# EAGLE design 04A-020 (EAGLE 9.6.2)
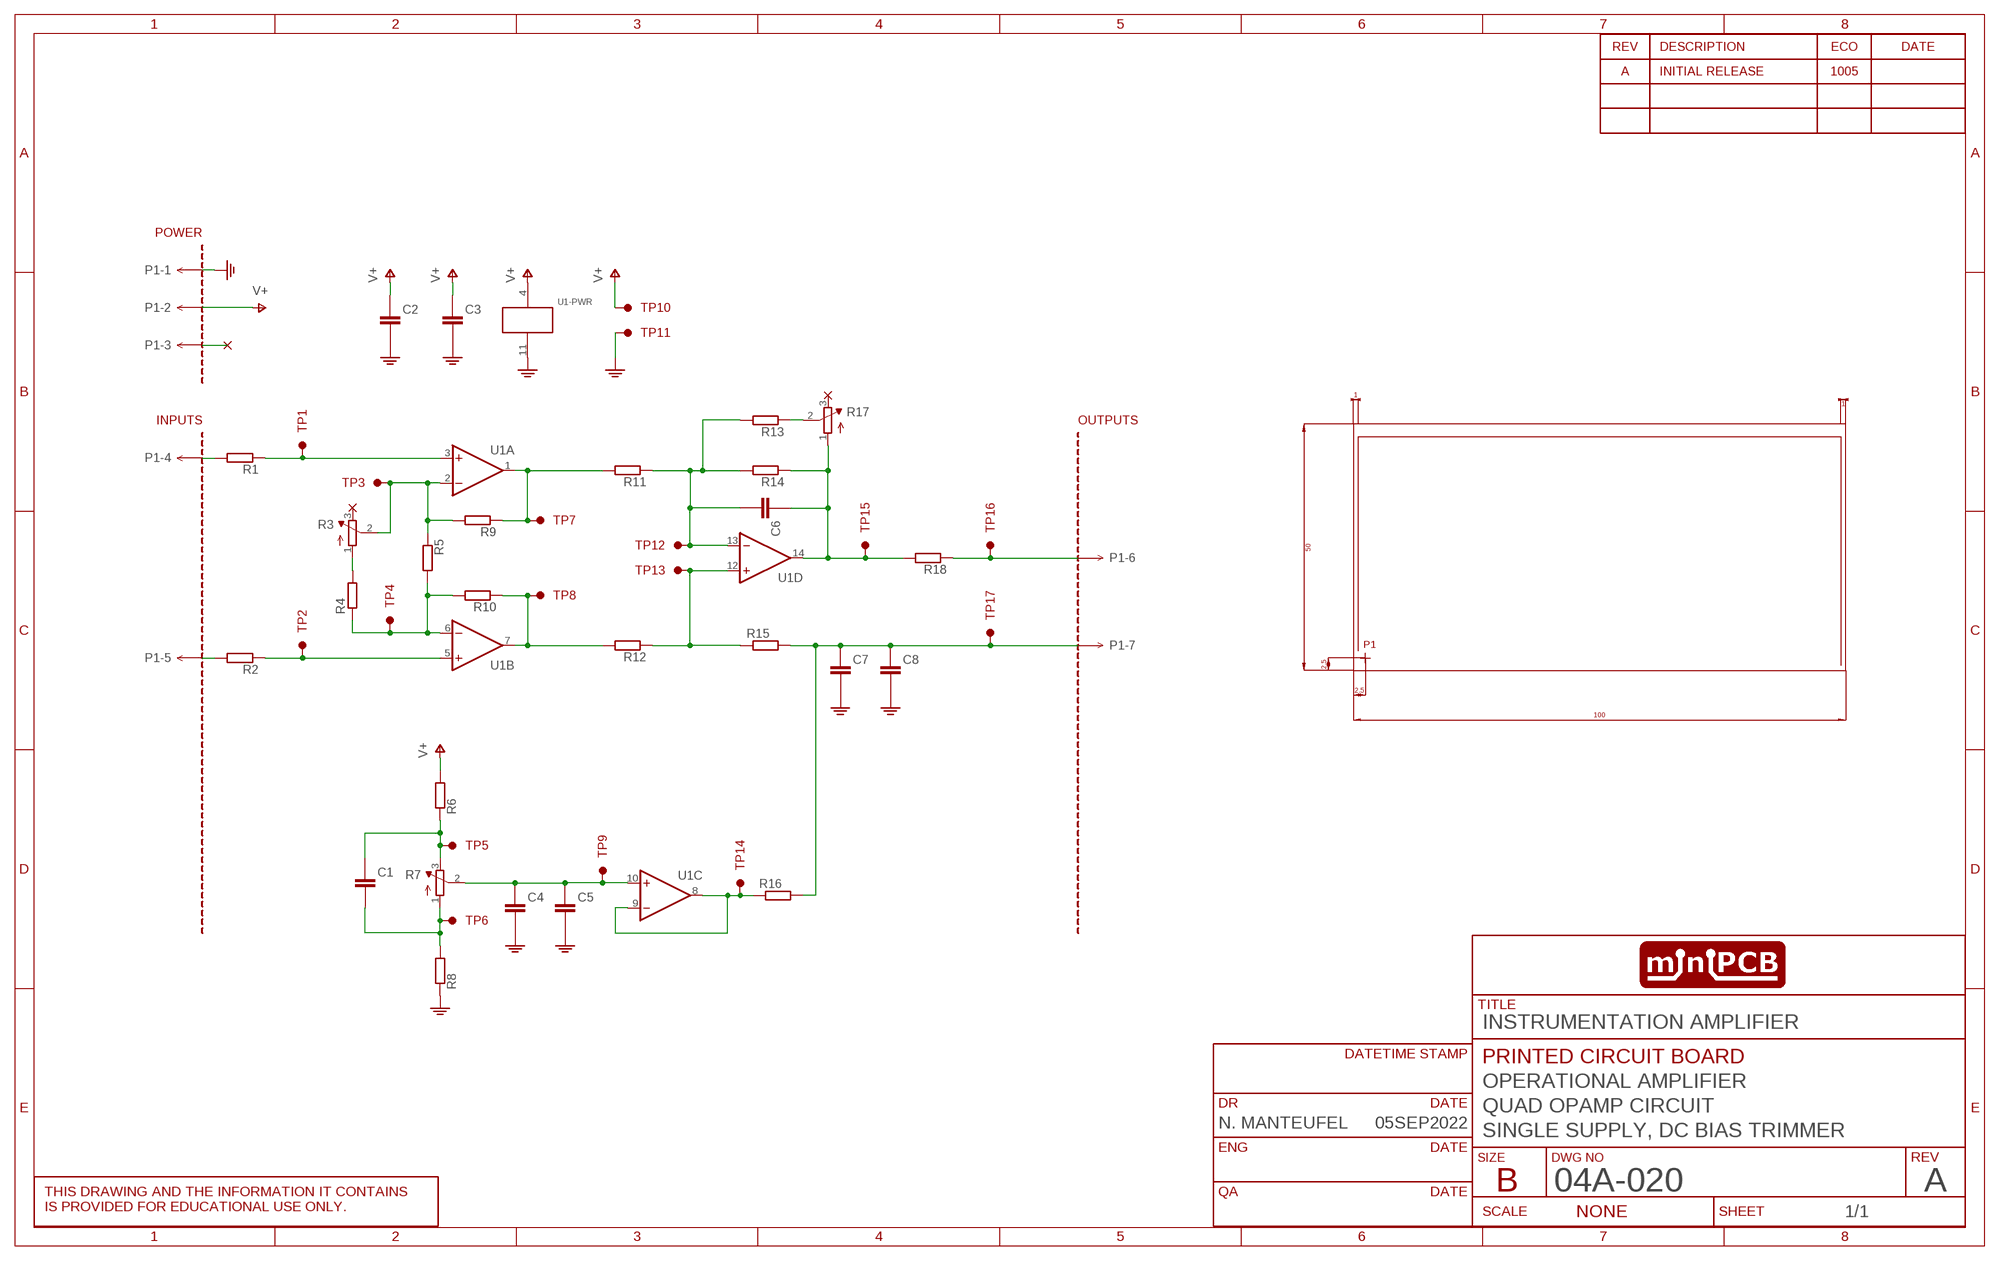
[diagram p0: schematic, sheet 1]
SHEET1 (SCHEMATIC): CIRCUIT_CATEGORY: OPERATIONAL AMPLIFIER; CIRCUIT_NAME: QUAD OPAMP CIRCUIT; CIRCUIT_VARIANT: SINGLE SUPPLY, DC BIAS TRIMMER; DR: N. MANTEUFEL; DR_DATE: 05SEP2022; PCB_PCBA: PRINTED CIRCUIT BOARD; REVA: A; REVA_ECO: 1005; REVISION: A; TITLE: INSTRUMENTATION AMPLIFIER

## Parts
C1  CAPACITORTHD  [C050-024X044]
C2  CAPACITOR_10  [C5MM]
C3  CAPACITORTHD  [C050-024X044]
C4  CAPACITOR_10  [C5MM]
C5  CAPACITORTHD  [C050-024X044]
C6  CAPACITORTHD  [C050-024X044]
C7  CAPACITOR_10  [C5MM]
C8  CAPACITORTHD  [C050-024X044]
P1  MINIPCB_7P  [PINS_1X7]
R1  RESISTOR10MM  [0207/10]
R2  RESISTOR10MM  [0207/10]
R3  TRIMPOT0.100THD  [TRIM_0100]
R4  RESISTOR10MM  [0207/10]
R5  RESISTOR10MM  [0207/10]
R6  RESISTOR10MM  [0207/10]
R7  TRIMPOT0.100THD  [TRIM_0100]
R8  RESISTOR10MM  [0207/10]
R9  RESISTOR10MM  [0207/10]
R10  RESISTOR10MM  [0207/10]
R11  RESISTOR10MM  [0207/10]
R12  RESISTOR10MM  [0207/10]
R13  RESISTOR10MM  [0207/10]
R14  RESISTOR10MM  [0207/10]
R15  RESISTOR10MM  [0207/10]
R16  RESISTOR10MM  [0207/10]
R17  TRIMPOT0.100THD  [TRIM_0100]
R18  RESISTOR10MM  [0207/10]
TP1  TESTPOINTKE5000-SMTEXT  [PINS_1_TESTPOINT_KE5000_NOTEXT]
TP2  TESTPOINTKE5000-SMTEXT  [PINS_1_TESTPOINT_KE5000_NOTEXT]
TP3  TESTPOINTKE5000-SMTEXT  [PINS_1_TESTPOINT_KE5000_NOTEXT]
TP4  TESTPOINTKE5000-SMTEXT  [PINS_1_TESTPOINT_KE5000_NOTEXT]
TP5  TESTPOINTKE5000-SMTEXT  [PINS_1_TESTPOINT_KE5000_NOTEXT]
TP6  TESTPOINTKE5000-SMTEXT  [PINS_1_TESTPOINT_KE5000_NOTEXT]
TP7  TESTPOINTKE5000-SMTEXT  [PINS_1_TESTPOINT_KE5000_NOTEXT]
TP8  TESTPOINTKE5000-SMTEXT  [PINS_1_TESTPOINT_KE5000_NOTEXT]
TP9  TESTPOINTKE5000-SMTEXT  [PINS_1_TESTPOINT_KE5000_NOTEXT]
TP10  TESTPOINTKE5000-SMTEXT  [PINS_1_TESTPOINT_KE5000_NOTEXT]
TP11  TESTPOINTKE5000-SMTEXT  [PINS_1_TESTPOINT_KE5000_NOTEXT]
TP12  TESTPOINTKE5000-SMTEXT  [PINS_1_TESTPOINT_KE5000_NOTEXT]
TP13  TESTPOINTKE5000-SMTEXT  [PINS_1_TESTPOINT_KE5000_NOTEXT]
TP14  TESTPOINTKE5000-SMTEXT  [PINS_1_TESTPOINT_KE5000_NOTEXT]
TP15  TESTPOINTKE5000-SMTEXT  [PINS_1_TESTPOINT_KE5000_NOTEXT]
TP16  TESTPOINTKE5000-SMTEXT  [PINS_1_TESTPOINT_KE5000_NOTEXT]
TP17  TESTPOINTKE5000-SMTEXT  [PINS_1_TESTPOINT_KE5000_NOTEXT]
U1  OPAMP_QUADTHD  [DIL14]
U2  CLASSIC-50X100  [PCB50X100]

## Nets
BIAS: C4.+ C5.1(+) R7.2(S) TP9.1 U1.10(C:+IN)
GND: C2.- C3.2(-) C4.- C5.2(-) C7.- C8.2(-) P1.1 R8.1 TP11.1 U1.11(-PWR:V-)
N$1: R12.1 R15.1 TP13.1 U1.12(D:+IN)
N$2: C7.+ C8.1(+) P1.7 R15.2 R16.2 TP17.1
N$3: R2.1 TP2.1 U1.5(B:+IN)
N$4: R1.1 TP1.1 U1.3(A:+IN)
N$5: R3.2(S) R5.1 R9.2 TP3.1 U1.2(A:-IN)
N$6: R4.1 R5.2 R10.2 TP4.1 U1.6(B:-IN)
N$7: R9.1 R11.2 TP7.1 U1.1(A:OUT)
N$8: R10.1 R12.2 TP8.1 U1.7(B:OUT)
N$9: R16.1 TP14.1 U1.8(C:OUT) U1.9(C:-IN)
N$10: R3.1(A) R4.2
N$11: P1.6 R18.1 TP16.1
N$12: R13.1 R17.2(S)
N$13: P1.4 R1.2
N$14: P1.5 R2.2
NC: P1.3
OUT: C6.1(+) R14.1 R17.1(A) R18.2 TP15.1 U1.14(D:OUT)
POT.1: C1.2(-) R7.1(A) R8.2 TP6.1
POT.3: C1.1(+) R6.1 R7.3(E) TP5.1
V+: C2.+ C3.1(+) P1.2 R6.2 TP10.1 U1.4(-PWR:V+)
VFB: C6.2(-) R11.1 R13.2 R14.2 TP12.1 U1.13(D:-IN)
Unconnected: R3.3(E) R17.3(E)

## Library data of the parts
C1-C8 = minipcb:CAPACITOR
P1 = minipcb:MINIPCB_7P
R1 R2 R4-R6 R8-R16 R18 = minipcb:RESISTOR
R3 R7 R17 = minipcb:TRIMPOT: SMT trimmer potentiometer part number TC33X http://www.ladyada.net/library/eagle
TP1-TP17 = minipcb:TESTPOINT
U1 = minipcb:OPAMP_QUAD: OP AMP
U2 = miniPCB_BOARDS:CLASSIC; PART_NUMBER: 04A-020; REVISION: A1-01; TITLE: miniPCB, INSTRUMENTATION AMPLIFIER

## Board
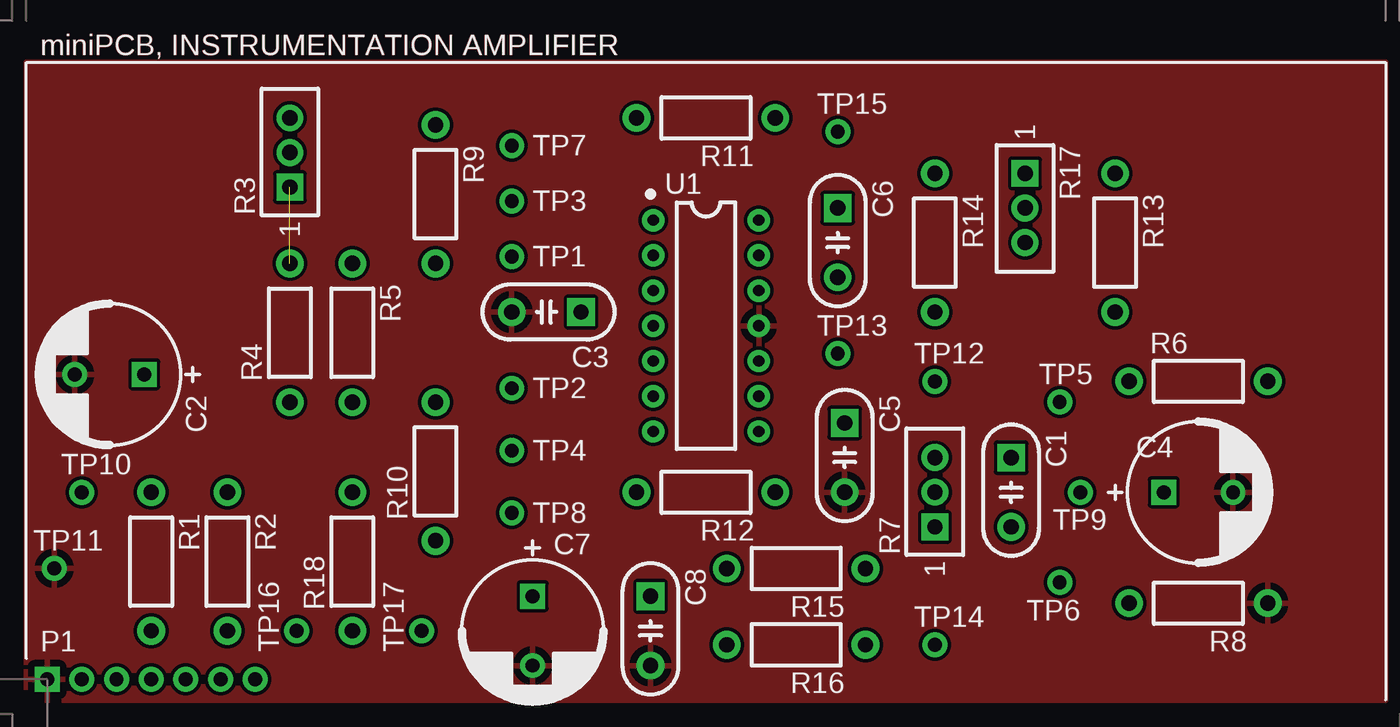
[diagram p1: board, top side]
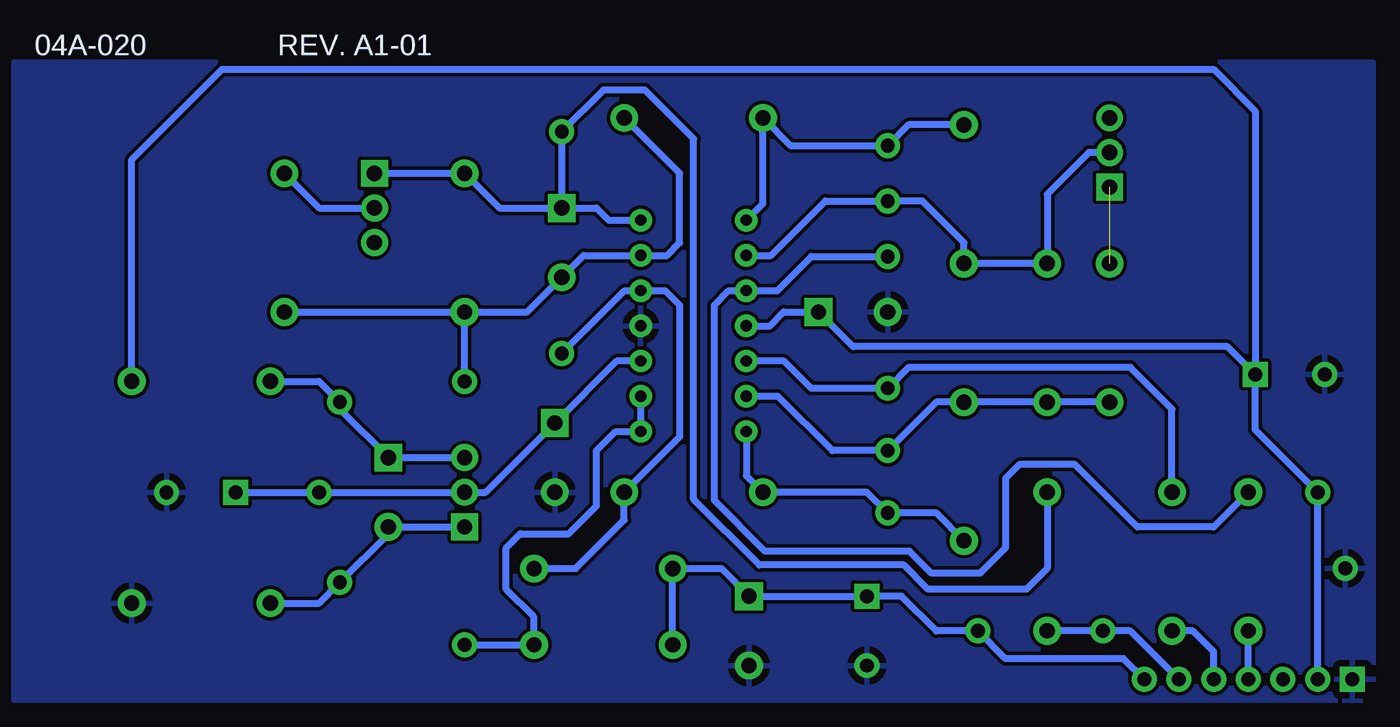
[diagram p2: board, bottom side, seen from below]

No outline drawn. Coordinates in mm, seen from the top.
Copper layers (1*16): Top 0.035mm / dielectric 1.5mm / Bottom 0.035mm
Design rules "minipcb": minimum track width 0.2mm, minimum drill 0.5mm, track to track 0.25mm, track to pad 0.5mm, pad to pad 0.5mm, via to via 0.5mm, smd to smd 0.15mm, copper to edge 1mm, drill to drill 1mm, minimum pad ring 0.4mm, minimum via ring 0.4mm, stop-mask expansion 0.1mm, vias tented up to drill 0.6mm, thermal gap 0.5mm

### Footprints (pad centres in the part's own frame; a part is rotated, then mirrored left to right if it is on the bottom)
C050-024X044 = drill 1.1 pad 2 square: 1 -2.5,0 | drill 1.1 pad 2: 2 2.5,0
C5MM = drill 1 square: + -2.5,0 | drill 1: - 2.5,0
PINS_1X7 = drill 1 square: 1 0,0 | drill 1: 2 2.5,0; 3 5,0; 4 7.5,0; 5 10,0; 6 12.5,0; 7 15,0
0207/10 = drill 1.1 pad 2: 1 -5,0; 2 5,0
TRIM_0100 = drill 1.1 pad 1.93 square: 1 0,0 | drill 1.1 pad 1.93: 2 2.5,0; 3 5,0
PINS_1_TESTPOINT_KE5000_NOTEXT = drill 1: 1 0,0
DIL14 = drill 0.813: 1 -7.62,-3.81; 2 -5.08,-3.81; 3 -2.54,-3.81; 4 0,-3.81; 5 2.54,-3.81; 6 5.08,-3.81; 7 7.62,-3.81; 8 7.62,3.81; 9 5.08,3.81; 10 2.54,3.81; 11 0,3.81; 12 -2.54,3.81; 13 -5.08,3.81; 14 -7.62,3.81

### Placement (x,y rotation side)
C1  72,16 270 top
C2  7,24.5 180 top
C3  38.5,29 180 top
C4  85.5,16 0 top
C5  60,18.5 270 top
C6  59.5,34 270 top
C7  37.5,6 270 top
C8  46,6 270 top
P1  2.5,2.5 0 top
R1  10,11 270 top
R2  15.5,11 270 top
R3  20,38 90 top
R4  20,27.5 90 top
R5  24.5,27.5 270 top
R6  85.5,24 0 top
R7  66.5,13.5 90 top
R8  85.5,8 180 top
R9  30.5,37.5 270 top
R10  30.5,17.5 90 top
R11  50,43 180 top
R12  50,16 180 top
R13  79.5,34 270 top
R14  66.5,34 270 top
R15  56.5,10.5 180 top
R16  56.5,5 180 top
R17  73,39 270 top
R18  24.5,11 90 top
TP1  36,33 0 top
TP2  36,23.5 0 top
TP3  36,37 0 top
TP4  36,19 270 top
TP5  75.5,22.5 0 top
TP6  75.5,9.5 180 top
TP7  36,41 0 top
TP8  36,14.5 0 top
TP9  77,16 0 top
TP10  5,16 0 top
TP11  3,10.5 0 top
TP12  66.5,24 0 top
TP13  59.5,26 0 top
TP14  66.5,5 0 top
TP15  59.5,42 0 top
TP16  20.5,6 90 top
TP17  29.5,6 90 top
U1  50,28 270 top
U2  0,0 0 top

### Tracks (layer width: path | path; a pad name or v marks a point on that pad's centre or on a via)
BIAS
  Bottom 0.5: C4.+ TP9.1 R7.2 65,16 C5.1 55.54,25.46 U1.10
GND
  pour Bottom: 1,1 99,1 99,47 1,47
  pour Top: 1,1 99,1 99,47 1,47
N$1
  Bottom 0.5: TP13.1 54.96,30.54 U1.12 52.04,30.54 51,29.5 51,20 R12.1 55,14 58.5,10.5 R15.1
N$2
  Bottom 0.5: R16.2 R15.2 48,10.5 C8.1 C7.+ 35,8.5 32.5,6 TP17.1 27.5,4 19,4 P1.7
N$3
  Bottom 0.5: U1.5 43.46,25.46 41.5,23.5 TP2.1 34.5,25 18.5,25 15.5,22 R2.1
N$4
  Bottom 0.5: TP1.1 41.5,33 43.96,30.54 U1.3 47.46,30.54 48.5,29.5 48.5,15.41 44.84,11.75 34.42,11.75 32.84,10.16 29.34,10.16 27.5,12 27.5,17 26.5,18 22.5,18 18,13.5 12.5,13.5 R1.1
N$5
  Bottom 0.5: R3.2 21.5,40.5 24.5,37.5 R5.1 R9.2 30.5,34 33.5,37 TP3.1 40.5,37 44.42,33.08 U1.2
N$6
  Bottom 0.5: R4.1 R5.2 R10.2 32.5,22.5 TP4.1 40,19 43.92,22.92 U1.6
N$7
  Bottom 0.5: U1.1 45,36.81 R11.2 43,41 TP7.1 34.5,42.5 R9.1
N$8
  Bottom 0.5: R10.1 32.5,14.5 TP8.1 37.5,16 R12.2 46.19,17.19 U1.7
N$9
  Bottom 0.5: U1.9 U1.8 55.62,20.38 57,19 57,15 59,13 62.5,13 63.5,12 63.5,9 61.5,7 R16.1 TP14.1
N$10  (1 unrouted)
N$11
  Bottom 0.5: P1.6 18.5,6 TP16.1 R18.1
N$12
  Bottom 0.5: R13.1 77,36.5 R17.2
N$13
  Bottom 0.5: P1.4 R1.2
N$14
  Bottom 0.5: P1.5 12.5,4.5 14,6 R2.2
OUT
  Bottom 0.5: R17.1 R14.1 64,36.5 C6.1 | C6.1 57,36.5 56.12,35.62 U1.14 | C6.1 TP15.1 56.5,45 53.5,45 50,41.5 50,15.5 45.25,10.75 34.84,10.75 33.09,9 26,9 24.5,10.5 R18.2
POT.1
  Bottom 0.5: R8.2 77,8 TP6.1 72,13 C1.2 R7.1
POT.3
  Bottom 0.5: R6.1 77,24 TP5.1 75.5,22 C1.1 R7.3
V+
  Bottom 0.5: R6.2 90.5,40 84,46.5 12.5,46.5 9.5,43.5 C2.+ | P1.2 TP10.1 9.5,20.5 C2.+ | U1.4 44.5,28 43.5,29 C3.1 38.5,26.5 11.5,26.5 C2.+
VFB
  Bottom 0.5: TP12.1 R14.2 | R13.2 R14.2 | R11.1 51,39 51,34 51.92,33.08 U1.13 57.92,33.08 C6.2 62,29 R14.2